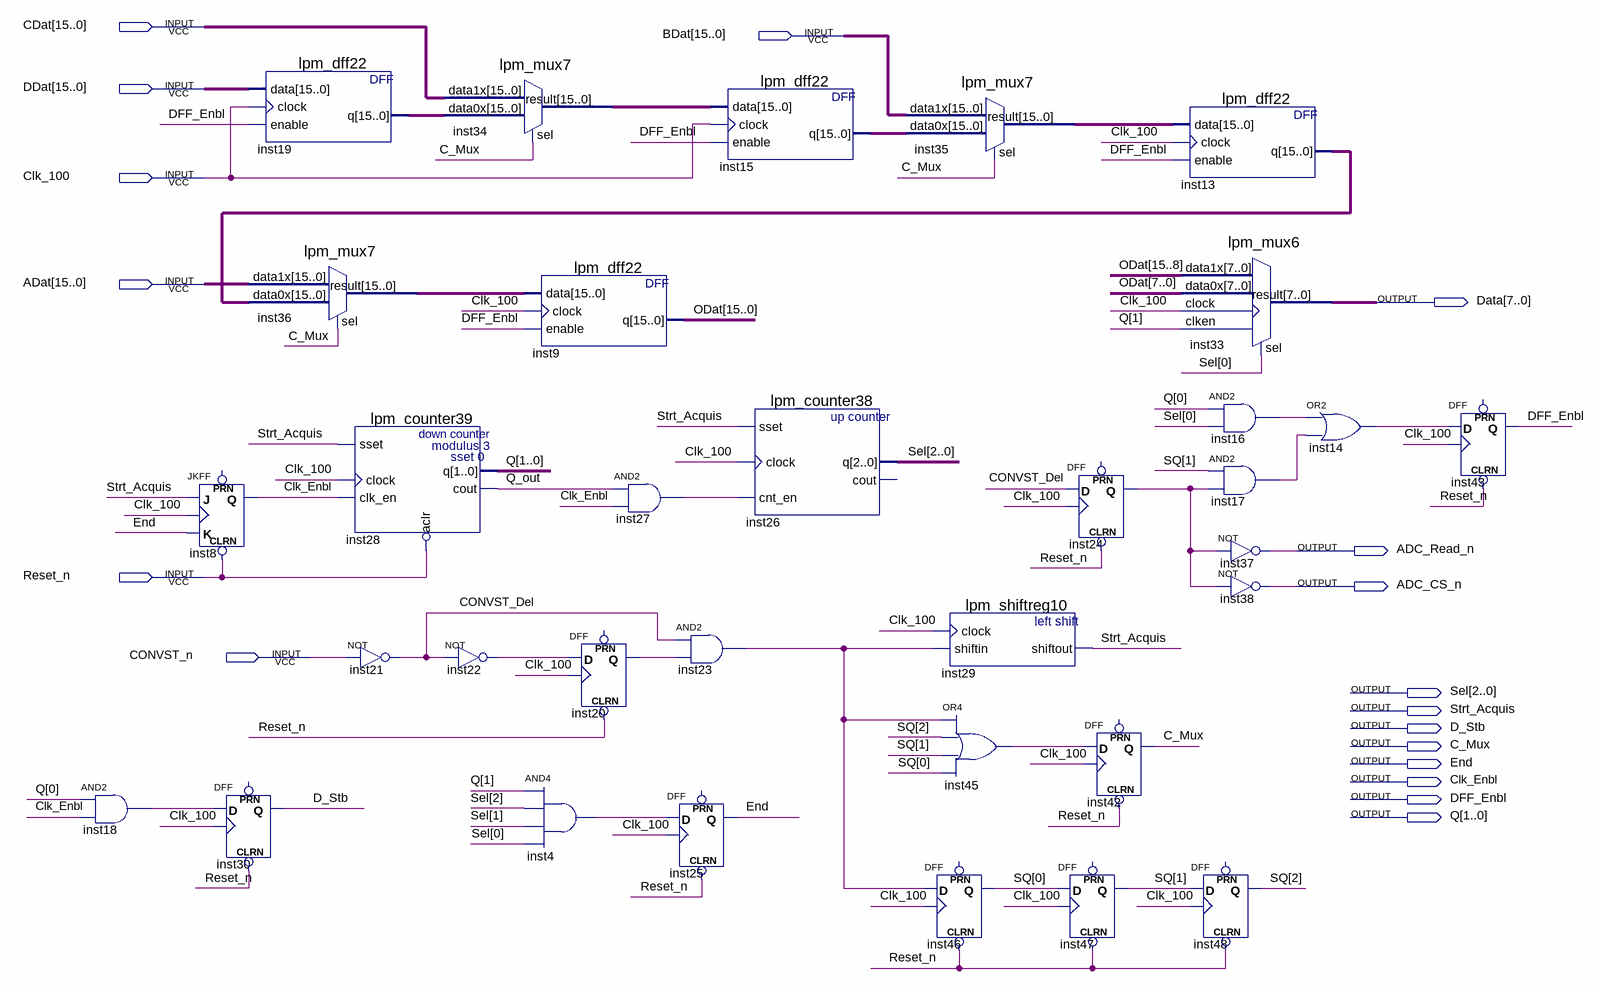
[diagram p0: schematic sheet]
// Quartus schematic CCD_Simulator.bdf as structural Verilog: 33 symbols, 18 pins
module CCD_Simulator (
  input  [15:0] CDat,
  input  [15:0] BDat,
  input  [15:0] DDat,
  input  Clk_100,
  input  [15:0] ADat,
  input  Reset_n,
  input  CONVST_n,
  output [7:0] Data,
  output ADC_Read_n,
  output ADC_CS_n,
  output [2:0] Sel,
  output Strt_Acquis,
  output D_Stb,
  output C_Mux,
  output End,
  output Clk_Enbl,
  output DFF_Enbl,
  output [1:0] Q
);

  wire CONVST_Del, inst4_out, inst14_out, inst16_out, inst17_out, inst18_out, inst20_q, inst22_out,
       inst23_out, inst24_q, inst27_out, inst45_out, Q_out;
  wire [2:0] SQ;
  wire [15:0] inst13_q, inst15_q, inst19_q, inst34_result, inst35_result, inst36_result, ODat;

  and inst18 (inst18_out, Q[0], Clk_Enbl);
  JKFF inst8 (.CLRN(Reset_n), .K(End), .J(Strt_Acquis), .CLK(Clk_100), .Q(Clk_Enbl));  // open: PRN
  lpm_dff22 inst19 (.data(DDat), .clock(Clk_100), .enable(DFF_Enbl), .q(inst19_q));
  lpm_mux7 inst36 (.data1x(ADat), .data0x(inst13_q), .sel(C_Mux), .result(inst36_result));
  DFF inst30 (.CLRN(Reset_n), .CLK(Clk_100), .D(inst18_out), .Q(D_Stb));  // open: PRN
  lpm_counter39 inst28 (.sset(Strt_Acquis), .clock(Clk_100), .clk_en(Clk_Enbl), .aclr(~Reset_n), .q(Q), .cout(Q_out));
  not inst21 (CONVST_Del, CONVST_n);
  lpm_mux7 inst34 (.data1x(CDat), .data0x(inst19_q), .sel(C_Mux), .result(inst34_result));
  not inst22 (inst22_out, CONVST_Del);
  lpm_dff22 inst9 (.data(inst36_result), .clock(Clk_100), .enable(DFF_Enbl), .q(ODat));
  and inst4 (inst4_out, Q[1], Sel[2], Sel[1], Sel[0]);
  and inst27 (inst27_out, Q_out, Clk_Enbl);
  DFF inst20 (.CLRN(Reset_n), .CLK(Clk_100), .D(inst22_out), .Q(inst20_q));  // open: PRN
  and inst23 (inst23_out, CONVST_Del, inst20_q);
  DFF inst25 (.CLRN(Reset_n), .CLK(Clk_100), .D(inst4_out), .Q(End));  // open: PRN
  lpm_dff22 inst15 (.data(inst34_result), .clock(Clk_100), .enable(DFF_Enbl), .q(inst15_q));
  lpm_counter38 inst26 (.sset(Strt_Acquis), .clock(Clk_100), .cnt_en(inst27_out), .q(Sel));  // open: cout
  lpm_mux7 inst35 (.data1x(BDat), .data0x(inst15_q), .sel(C_Mux), .result(inst35_result));
  lpm_shiftreg10 inst29 (.clock(Clk_100), .shiftin(inst23_out), .shiftout(Strt_Acquis));
  or inst45 (inst45_out, inst23_out, SQ[2], SQ[1], SQ[0]);
  DFF inst46 (.CLRN(Reset_n), .CLK(Clk_100), .D(inst23_out), .Q(SQ[0]));  // open: PRN
  DFF inst47 (.CLRN(Reset_n), .CLK(Clk_100), .D(SQ[0]), .Q(SQ[1]));  // open: PRN
  DFF inst24 (.CLRN(Reset_n), .CLK(Clk_100), .D(CONVST_Del), .Q(inst24_q));  // open: PRN
  DFF inst42 (.CLRN(Reset_n), .CLK(Clk_100), .D(inst45_out), .Q(C_Mux));  // open: PRN
  lpm_dff22 inst13 (.data(inst35_result), .clock(Clk_100), .enable(DFF_Enbl), .q(inst13_q));
  lpm_mux6 inst33 (.data1x(ODat[15:8]), .data0x(ODat[7:0]), .clock(Clk_100), .clken(Q[1]), .sel(Sel[0]), .result(Data));
  DFF inst48 (.CLRN(Reset_n), .CLK(Clk_100), .D(SQ[1]), .Q(SQ[2]));  // open: PRN
  and inst16 (inst16_out, Q[0], Sel[0]);
  and inst17 (inst17_out, SQ[1], inst24_q);
  not inst37 (ADC_Read_n, inst24_q);
  not inst38 (ADC_CS_n, inst24_q);
  or inst14 (inst14_out, inst16_out, inst17_out);
  DFF inst43 (.CLRN(Reset_n), .CLK(Clk_100), .D(inst14_out), .Q(DFF_Enbl));  // open: PRN
endmodule
